# EAGLE design Reserve_nutzen_noholes (EAGLE 6.5.0)

## Sheet 1 of 5
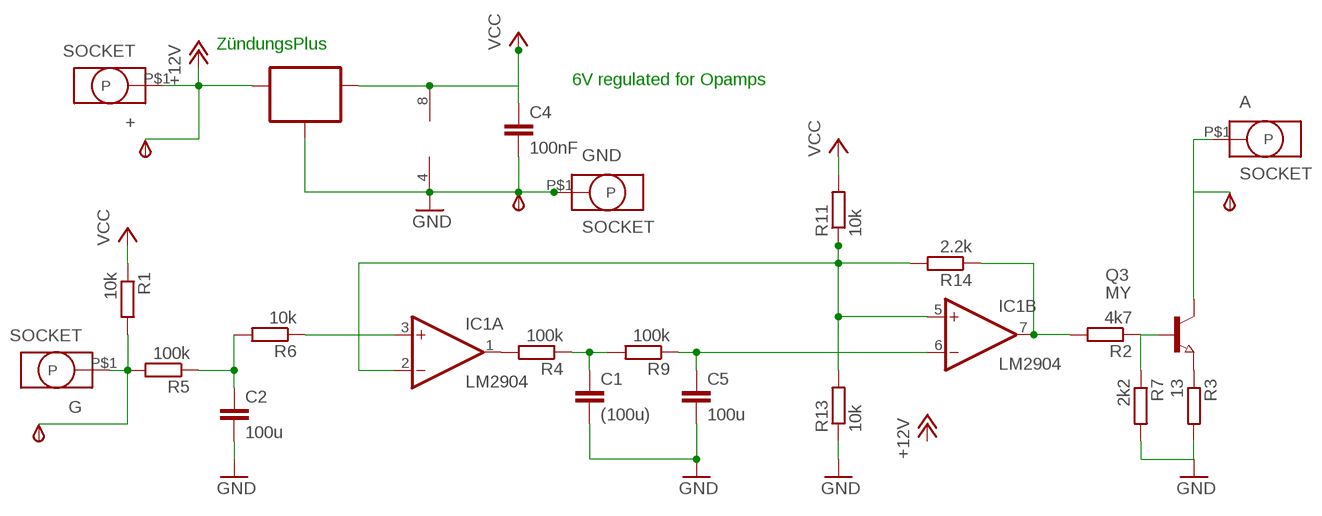
[diagram p0: schematic, sheet 1]

### Parts
+  SOCKET  [ID2.5MM]
A  SOCKET  [ID2.5MM]
C1  (100u)  C-EUC1206K  [C1206K]
C2  100u  C-EUC1206K  [C1206K]
C4  100nF  C-EUC0805  [C0805]
C5  100u  C-EUC1206K  [C1206K]
G  SOCKET  [ID2.5MM]
GND  SOCKET  [ID2.5MM]
GND_  TPSB2.0  [B2.0]
IC1  LM2904  LM358D  [SO08]
IC2  70L06  78LXXSOT89_ROUND  [SOT89_ROUND]
IN  TPSB2.0  [B2.0]
OUT  TPSB2.0  [B2.0]
Q3  MY  NPN-TRANSISTOR_SOT89  [SOT89]
R1  10k  R-EU_R0805  [R0805]
R2  4k7  R-EU_R0805  [R0805]
R3  13  R-EU_R1206  [R1206]
R4  100k  R-EU_R0805  [R0805]
R5  100k  R-EU_R0805  [R0805]
R6  10k  R-EU_R0805  [R0805]
R7  2k2  R-EU_R0805  [R0805]
R9  100k  R-EU_R0805  [R0805]
R11  10k  R-EU_R0805  [R0805]
R13  10k  R-EU_R0805  [R0805]
R14  2.2k  R-EU_R0805  [R0805]
V+  TPSB2.0  [B2.0]

### Nets
+12V: +.P$1(P) IC2.3(IN) V+.TP(PP)
GND: C1.2 C2.2 C4.2 C5.2 GND.P$1(P) GND_.TP(PP) IC1.4(P:V-) IC2.2(GND) IC2.2@1(GND) R3.2 R7.2 R13.1
N$1: C2.1 R5.1 R6.2
N$2: Q3.1(B) R2.1 R7.1
N$3: C1.1 R4.1 R9.2
N$4: C5.1 IC1.6(B:-IN) R9.1
N$5: IC1.2(A:-IN) IC1.5(B:+IN) R11.1 R13.2 R14.2
N$6: G.P$1(P) IN.TP(PP) R1.2 R5.2
N$7: Q3.3(E) R3.1
N$9: IC1.3(A:+IN) R6.1
N$10: IC1.7(B:OUT) R2.2 R14.1
N$11: A.P$1(P) OUT.TP(PP) Q3.2(C)
N$580: IC1.1(A:OUT) R4.2
VCC: C4.1 IC1.8(P:V+) IC2.1(OUT) R1.1 R11.2

### Notes on the sheet
- ZündungsPlus
- 6V regulated for Opamps

## Sheet 2 of 5
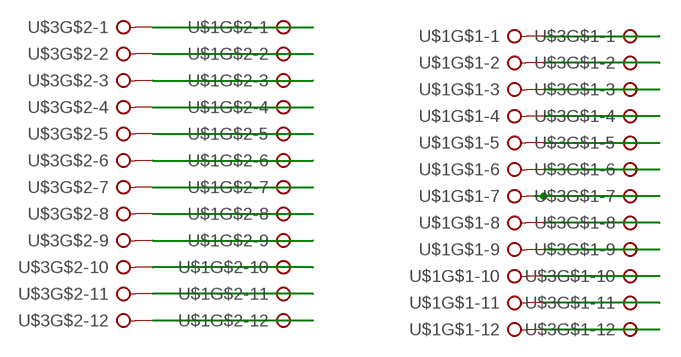
[diagram p1: schematic, sheet 2]

### Parts
U$1  TESTADAPTER-24P  [24-PIN-TESTADAPTER]
U$3  TESTADAPTER-24P24-PIN-ANSCHLUSS  [24-PIN-ANSCHLUSS]

### Nets
N$20: U$1.P$2-1 U$3.P$2-1
N$21: U$1.P$2-2 U$3.P$2-2
N$22: U$1.P$2-3 U$3.P$2-3
N$23: U$1.P$2-4 U$3.P$2-4
N$24: U$1.P$2-5 U$3.P$2-5
N$25: U$1.P$2-6 U$3.P$2-6
N$26: U$1.P$2-7 U$3.P$2-7
N$27: U$1.P$2-8 U$3.P$2-8
N$28: U$1.P$2-9 U$3.P$2-9
N$29: U$1.P$2-10 U$3.P$2-10
N$30: U$1.P$2-11 U$3.P$2-11
N$31: U$1.P$2-12 U$3.P$2-12
N$32: U$1.P$1-2 U$3.P$1-2
N$33: U$1.P$1-3 U$3.P$1-3
N$34: U$1.P$1-4 U$3.P$1-4
N$35: U$1.P$1-6 U$3.P$1-6
N$36: U$1.P$1-7 U$3.P$1-7
N$37: U$1.P$1-8 U$3.P$1-8
N$38: U$1.P$1-9 U$3.P$1-9
N$39: U$1.P$1-10 U$3.P$1-10
N$40: U$1.P$1-11 U$3.P$1-11
N$41: U$1.P$1-12 U$3.P$1-12
N$42: U$1.P$1-5 U$3.P$1-5
N$43: U$1.P$1-1 U$3.P$1-1

## Sheet 3 of 5
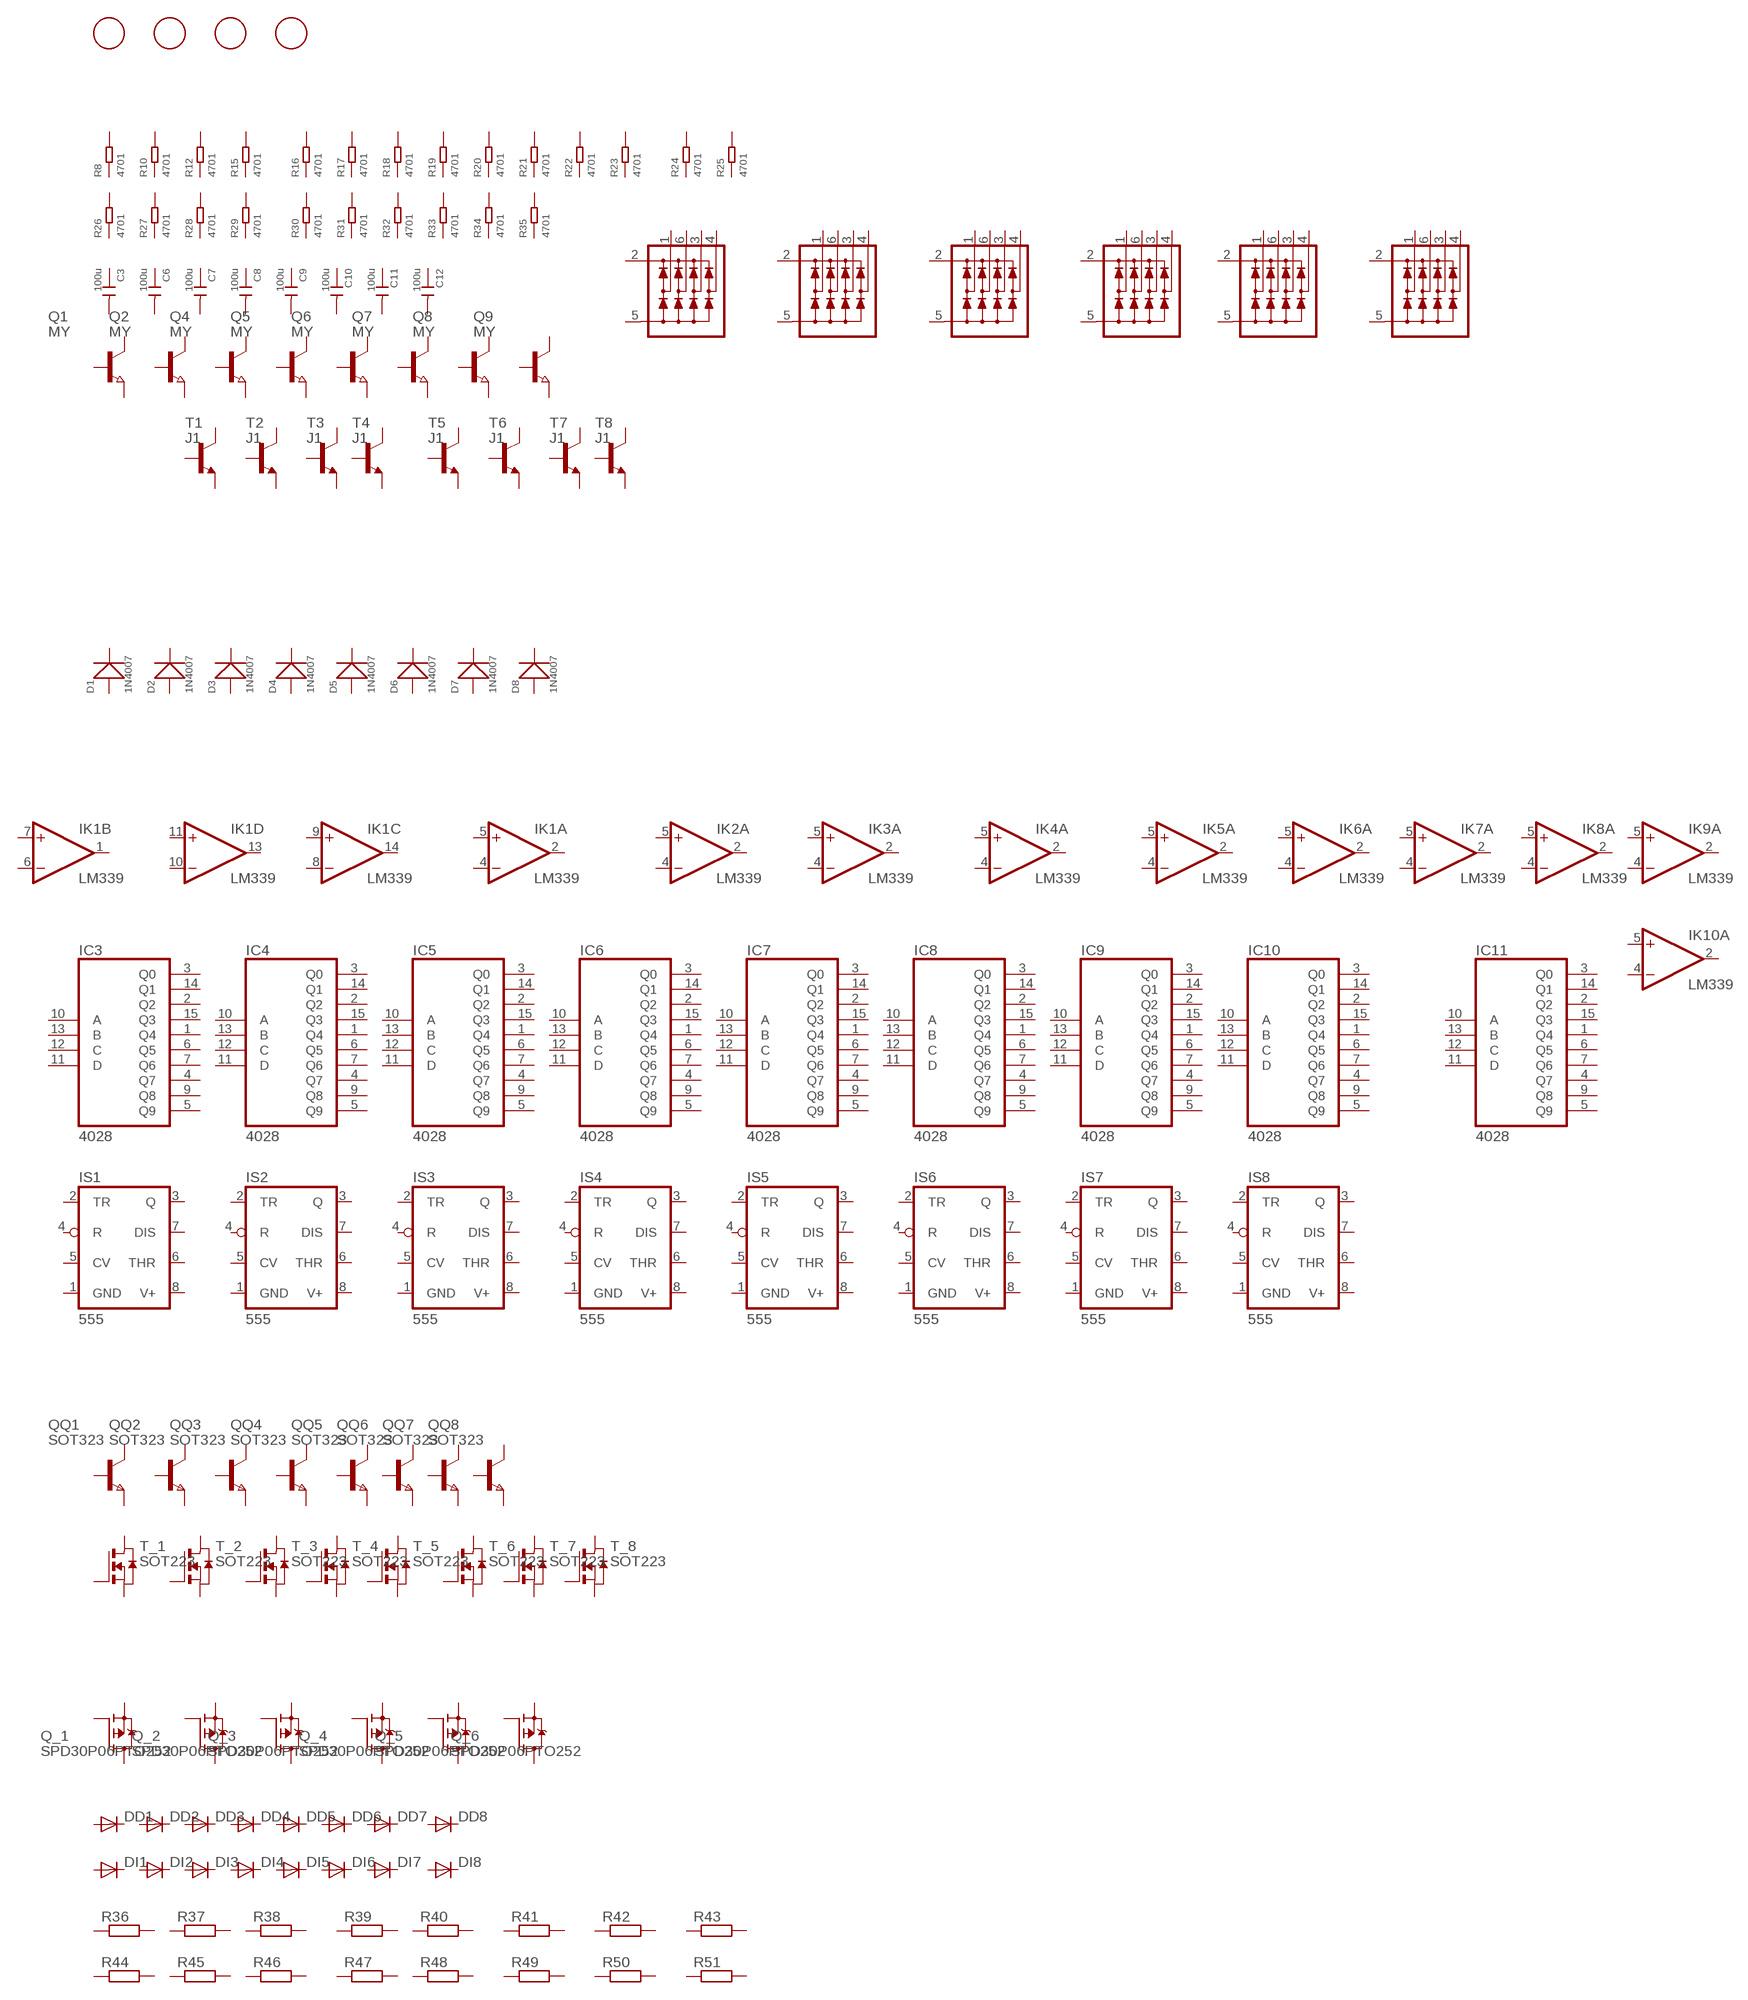
[diagram p2: schematic, sheet 3]

### Parts
C3  100u  CERAMIC-100UF-6.3V-20%-X5R(1206)  [C1206]
C6  100u  CERAMIC-100UF-6.3V-20%-X5R(1206)  [C1206]
C7  100u  CERAMIC-100UF-6.3V-20%-X5R(1206)  [C1206]
C8  100u  CERAMIC-100UF-6.3V-20%-X5R(1206)  [C1206]
C9  100u  CERAMIC-100UF-6.3V-20%-X5R(1206)  [C1206]
C10  100u  CERAMIC-100UF-6.3V-20%-X5R(1206)  [C1206]
C11  100u  CERAMIC-100UF-6.3V-20%-X5R(1206)  [C1206]
C12  100u  CERAMIC-100UF-6.3V-20%-X5R(1206)  [C1206]
D1  1N4007  DIODE-GEN-PURPOSE-1KV-1A(DO-214AC)  [DO-214AC]
D2  1N4007  DIODE-GEN-PURPOSE-1KV-1A(DO-214AC)  [DO-214AC]
D3  1N4007  DIODE-GEN-PURPOSE-1KV-1A(DO-214AC)  [DO-214AC]
D4  1N4007  DIODE-GEN-PURPOSE-1KV-1A(DO-214AC)  [DO-214AC]
D5  1N4007  DIODE-GEN-PURPOSE-1KV-1A(DO-214AC)  [DO-214AC]
D6  1N4007  DIODE-GEN-PURPOSE-1KV-1A(DO-214AC)  [DO-214AC]
D7  1N4007  DIODE-GEN-PURPOSE-1KV-1A(DO-214AC)  [DO-214AC]
D8  1N4007  DIODE-GEN-PURPOSE-1KV-1A(DO-214AC)  [DO-214AC]
DD1  DIODE-SOD123  [SOD123]
DD2  DIODE-SOD123  [SOD123]
DD3  DIODE-SOD123  [SOD123]
DD4  DIODE-SOD123  [SOD123]
DD5  DIODE-SOD123  [SOD123]
DD6  DIODE-SOD123  [SOD123]
DD7  DIODE-SOD123  [SOD123]
DD8  DIODE-SOD123  [SOD123]
DI1  DIODE-SOD323-R  [SOD323-R]
DI2  DIODE-SOD323-R  [SOD323-R]
DI3  DIODE-SOD323-R  [SOD323-R]
DI4  DIODE-SOD323-R  [SOD323-R]
DI5  DIODE-SOD323-R  [SOD323-R]
DI6  DIODE-SOD323-R  [SOD323-R]
DI7  DIODE-SOD323-R  [SOD323-R]
DI8  DIODE-SOD323-R  [SOD323-R]
FID1_  FID2  FIDUCIAL  [FIDUCIAL_1MM]
FID2  FID1  FIDUCIAL  [FIDUCIAL_1MM]
FID3_  FIDUCIAL  [FIDUCIAL_1MM]
FID4  FIDUCIAL  [FIDUCIAL_1MM]
IC3  4028  4028D  [SO16]
IC4  4028  4028D  [SO16]
IC5  4028  4028D  [SO16]
IC6  4028  4028D  [SO16]
IC7  4028  4028D  [SO16]
IC8  4028  4028D  [SO16]
IC9  4028  4028D  [SO16]
IC10  4028  4028D  [SO16]
IC11  4028  4028D  [SO16]
IK1  LM339  LM339D  [SO14]
IK2  LM339  LM339D  [SO14]
IK3  LM339  LM339D  [SO14]
IK4  LM339  LM339D  [SO14]
IK5  LM339  LM339D  [SO14]
IK6  LM339  LM339D  [SO14]
IK7  LM339  LM339D  [SO14]
IK8  LM339  LM339D  [SO14]
IK9  LM339  LM339D  [SO14]
IK10  LM339  LM339D  [SO14]
IS1  555  NE555D  [SO08]
IS2  555  NE555D  [SO08]
IS3  555  NE555D  [SO08]
IS4  555  NE555D  [SO08]
IS5  555  NE555D  [SO08]
IS6  555  NE555D  [SO08]
IS7  555  NE555D  [SO08]
IS8  555  NE555D  [SO08]
Q1  MY  NPN-TRANSISTOR_SOT89  [SOT89]
Q2  MY  NPN-TRANSISTOR_SOT89  [SOT89]
Q4  MY  NPN-TRANSISTOR_SOT89  [SOT89]
Q5  MY  NPN-TRANSISTOR_SOT89  [SOT89]
Q6  MY  NPN-TRANSISTOR_SOT89  [SOT89]
Q7  MY  NPN-TRANSISTOR_SOT89  [SOT89]
Q8  MY  NPN-TRANSISTOR_SOT89  [SOT89]
Q9  MY  NPN-TRANSISTOR_SOT89  [SOT89]
Q_1  SPD30P06PTO252  [TO252]
Q_2  SPD30P06PTO252  [TO252]
Q_3  SPD30P06PTO252  [TO252]
Q_4  SPD30P06PTO252  [TO252]
Q_5  SPD30P06PTO252  [TO252]
Q_6  SPD30P06PTO252  [TO252]
QQ1  SOT323  NPNSOT323  [SOT323]
QQ2  SOT323  NPNSOT323  [SOT323]
QQ3  SOT323  NPNSOT323  [SOT323]
QQ4  SOT323  NPNSOT323  [SOT323]
QQ5  SOT323  NPNSOT323  [SOT323]
QQ6  SOT323  NPNSOT323  [SOT323]
QQ7  SOT323  NPNSOT323  [SOT323]
QQ8  SOT323  NPNSOT323  [SOT323]
R8  4701  SMD-RES-4.7K-5%-1/8W(0805)  [R0805]
R10  4701  SMD-RES-4.7K-5%-1/8W(0805)  [R0805]
R12  4701  SMD-RES-4.7K-5%-1/8W(0805)  [R0805]
R15  4701  SMD-RES-4.7K-5%-1/8W(0805)  [R0805]
R16  4701  SMD-RES-4.7K-5%-1/8W(0805)  [R0805]
R17  4701  SMD-RES-4.7K-5%-1/8W(0805)  [R0805]
R18  4701  SMD-RES-4.7K-5%-1/8W(0805)  [R0805]
R19  4701  SMD-RES-4.7K-5%-1/8W(0805)  [R0805]
R20  4701  SMD-RES-4.7K-5%-1/8W(0805)  [R0805]
R21  4701  SMD-RES-4.7K-5%-1/8W(0805)  [R0805]
R22  4701  SMD-RES-4.7K-5%-1/8W(0805)  [R0805]
R23  4701  SMD-RES-4.7K-5%-1/8W(0805)  [R0805]
R24  4701  SMD-RES-4.7K-5%-1/8W(0805)  [R0805]
R25  4701  SMD-RES-4.7K-5%-1/8W(0805)  [R0805]
R26  4701  SMD-RES-4.7K-5%-1/8W(0805)  [R0805]
R27  4701  SMD-RES-4.7K-5%-1/8W(0805)  [R0805]
R28  4701  SMD-RES-4.7K-5%-1/8W(0805)  [R0805]
R29  4701  SMD-RES-4.7K-5%-1/8W(0805)  [R0805]
R30  4701  SMD-RES-4.7K-5%-1/8W(0805)  [R0805]
R31  4701  SMD-RES-4.7K-5%-1/8W(0805)  [R0805]
R32  4701  SMD-RES-4.7K-5%-1/8W(0805)  [R0805]
R33  4701  SMD-RES-4.7K-5%-1/8W(0805)  [R0805]
R34  4701  SMD-RES-4.7K-5%-1/8W(0805)  [R0805]
R35  4701  SMD-RES-4.7K-5%-1/8W(0805)  [R0805]
R36  R-EU_R0603  [R0603]
R37  R-EU_R0603  [R0603]
R38  R-EU_R0603  [R0603]
R39  R-EU_R0603  [R0603]
R40  R-EU_R0603  [R0603]
R41  R-EU_R0603  [R0603]
R42  R-EU_R0603  [R0603]
R43  R-EU_R0603  [R0603]
R44  R-EU_R0402  [R0402]
R45  R-EU_R0402  [R0402]
R46  R-EU_R0402  [R0402]
R47  R-EU_R0402  [R0402]
R48  R-EU_R0402  [R0402]
R49  R-EU_R0402  [R0402]
R50  R-EU_R0402  [R0402]
R51  R-EU_R0402  [R0402]
T1  J1  MMBTA42LT1-NPN-SOT23-BEC  [SOT23-BEC]
T2  J1  MMBTA42LT1-NPN-SOT23-BEC  [SOT23-BEC]
T3  J1  MMBTA42LT1-NPN-SOT23-BEC  [SOT23-BEC]
T4  J1  MMBTA42LT1-NPN-SOT23-BEC  [SOT23-BEC]
T5  J1  MMBTA42LT1-NPN-SOT23-BEC  [SOT23-BEC]
T6  J1  MMBTA42LT1-NPN-SOT23-BEC  [SOT23-BEC]
T7  J1  MMBTA42LT1-NPN-SOT23-BEC  [SOT23-BEC]
T8  J1  MMBTA42LT1-NPN-SOT23-BEC  [SOT23-BEC]
T_1  SOT223  NMOSSOT223  [SOT223]
T_2  SOT223  NMOSSOT223  [SOT223]
T_3  SOT223  NMOSSOT223  [SOT223]
T_4  SOT223  NMOSSOT223  [SOT223]
T_5  SOT223  NMOSSOT223  [SOT223]
T_6  SOT223  NMOSSOT223  [SOT223]
T_7  SOT223  NMOSSOT223  [SOT223]
T_8  SOT223  NMOSSOT223  [SOT223]
U1  NUP4304SOT457_R  [SOT457R_PHILIPS]
U2  NUP4304SOT457_R  [SOT457R_PHILIPS]
U3  NUP4304SOT457_R  [SOT457R_PHILIPS]
U4  NUP4304SOT457_R  [SOT457R_PHILIPS]
U5  NUP4304SOT457_R  [SOT457R_PHILIPS]
U6  NUP4304SOT457_R  [SOT457R_PHILIPS]
Unconnected: C3.1 C3.2 C6.1 C6.2 C7.1 C7.2 C8.1 C8.2 C9.1 C9.2 C10.1 C10.2 C11.1 C11.2 C12.1 C12.2 D1.1(+) D1.2(-) D2.1(+) D2.2(-) D3.1(+) D3.2(-) D4.1(+) D4.2(-) D5.1(+) D5.2(-) D6.1(+) D6.2(-) D7.1(+) D7.2(-) D8.1(+) D8.2(-) DD1.A DD1.C DD2.A DD2.C DD3.A DD3.C DD4.A DD4.C DD5.A DD5.C DD6.A DD6.C DD7.A DD7.C DD8.A DD8.C DI1.A DI1.C DI2.A DI2.C DI3.A DI3.C DI4.A DI4.C DI5.A DI5.C DI6.A DI6.C DI7.A DI7.C DI8.A DI8.C IC3.1(Q4) IC3.2(Q2) IC3.3(Q0) IC3.4(Q7) IC3.5(Q9) IC3.6(Q5) IC3.7(Q6) IC3.9(Q8) IC3.10(A) IC3.11(D) IC3.12(C) IC3.13(B) IC3.14(Q1) IC3.15(Q3) IC4.1(Q4) IC4.2(Q2) IC4.3(Q0) IC4.4(Q7) IC4.5(Q9) IC4.6(Q5) IC4.7(Q6) IC4.9(Q8) IC4.10(A) IC4.11(D) IC4.12(C) IC4.13(B) IC4.14(Q1) IC4.15(Q3) IC5.1(Q4) IC5.2(Q2) IC5.3(Q0) IC5.4(Q7) IC5.5(Q9) IC5.6(Q5) IC5.7(Q6) IC5.9(Q8) IC5.10(A) IC5.11(D) IC5.12(C) IC5.13(B) IC5.14(Q1) IC5.15(Q3) IC6.1(Q4) IC6.2(Q2) IC6.3(Q0) IC6.4(Q7) IC6.5(Q9) IC6.6(Q5) IC6.7(Q6) IC6.9(Q8) IC6.10(A) IC6.11(D) IC6.12(C) IC6.13(B) IC6.14(Q1) IC6.15(Q3) IC7.1(Q4) IC7.2(Q2) IC7.3(Q0) IC7.4(Q7) IC7.5(Q9) IC7.6(Q5) IC7.7(Q6) IC7.9(Q8) IC7.10(A) IC7.11(D) IC7.12(C) IC7.13(B) IC7.14(Q1) IC7.15(Q3) IC8.1(Q4) IC8.2(Q2) IC8.3(Q0) IC8.4(Q7) IC8.5(Q9) IC8.6(Q5) IC8.7(Q6) IC8.9(Q8) IC8.10(A) IC8.11(D) IC8.12(C) IC8.13(B) IC8.14(Q1) IC8.15(Q3) IC9.1(Q4) IC9.2(Q2) IC9.3(Q0) IC9.4(Q7) IC9.5(Q9) IC9.6(Q5) IC9.7(Q6) IC9.9(Q8) IC9.10(A) IC9.11(D) IC9.12(C) IC9.13(B) IC9.14(Q1) IC9.15(Q3) IC10.1(Q4) IC10.2(Q2) IC10.3(Q0) IC10.4(Q7) IC10.5(Q9) IC10.6(Q5) IC10.7(Q6) IC10.9(Q8) IC10.10(A) IC10.11(D) IC10.12(C) IC10.13(B) IC10.14(Q1) IC10.15(Q3) IC11.1(Q4) IC11.2(Q2) IC11.3(Q0) IC11.4(Q7) IC11.5(Q9) IC11.6(Q5) IC11.7(Q6) IC11.9(Q8) IC11.10(A) IC11.11(D) IC11.12(C) IC11.13(B) IC11.14(Q1) IC11.15(Q3) IK1.1(B:OUT) IK1.2(A:OUT) IK1.4(A:-IN) IK1.5(A:+IN) IK1.6(B:-IN) IK1.7(B:+IN) IK1.8(C:-IN) IK1.9(C:+IN) IK1.10(D:-IN) IK1.11(D:+IN) IK1.13(D:OUT) IK1.14(C:OUT) IK2.1(B:OUT) IK2.2(A:OUT) IK2.4(A:-IN) IK2.5(A:+IN) IK2.6(B:-IN) IK2.7(B:+IN) IK2.8(C:-IN) IK2.9(C:+IN) IK2.10(D:-IN) IK2.11(D:+IN) IK2.13(D:OUT) IK2.14(C:OUT) IK3.1(B:OUT) IK3.2(A:OUT) IK3.4(A:-IN) IK3.5(A:+IN) IK3.6(B:-IN) IK3.7(B:+IN) IK3.8(C:-IN) IK3.9(C:+IN) IK3.10(D:-IN) IK3.11(D:+IN) IK3.13(D:OUT) IK3.14(C:OUT) IK4.1(B:OUT) IK4.2(A:OUT) IK4.4(A:-IN) IK4.5(A:+IN) IK4.6(B:-IN) IK4.7(B:+IN) IK4.8(C:-IN) IK4.9(C:+IN) IK4.10(D:-IN) IK4.11(D:+IN) IK4.13(D:OUT) IK4.14(C:OUT) IK5.1(B:OUT) IK5.2(A:OUT) IK5.4(A:-IN) IK5.5(A:+IN) IK5.6(B:-IN) IK5.7(B:+IN) IK5.8(C:-IN) IK5.9(C:+IN) IK5.10(D:-IN) IK5.11(D:+IN) IK5.13(D:OUT) IK5.14(C:OUT) IK6.1(B:OUT) IK6.2(A:OUT) IK6.4(A:-IN) IK6.5(A:+IN) IK6.6(B:-IN) IK6.7(B:+IN) IK6.8(C:-IN) IK6.9(C:+IN) IK6.10(D:-IN) IK6.11(D:+IN) IK6.13(D:OUT) IK6.14(C:OUT) IK7.1(B:OUT) IK7.2(A:OUT) IK7.4(A:-IN) IK7.5(A:+IN) IK7.6(B:-IN) IK7.7(B:+IN) IK7.8(C:-IN) IK7.9(C:+IN) IK7.10(D:-IN) IK7.11(D:+IN) IK7.13(D:OUT) IK7.14(C:OUT) IK8.1(B:OUT) IK8.2(A:OUT) IK8.4(A:-IN) IK8.5(A:+IN) IK8.6(B:-IN) IK8.7(B:+IN) IK8.8(C:-IN) IK8.9(C:+IN) IK8.10(D:-IN) IK8.11(D:+IN) IK8.13(D:OUT) IK8.14(C:OUT) IK9.1(B:OUT) IK9.2(A:OUT) IK9.4(A:-IN) IK9.5(A:+IN) IK9.6(B:-IN) IK9.7(B:+IN) IK9.8(C:-IN) IK9.9(C:+IN) IK9.10(D:-IN) IK9.11(D:+IN) IK9.13(D:OUT) IK9.14(C:OUT) IK10.1(B:OUT) IK10.2(A:OUT) IK10.4(A:-IN) IK10.5(A:+IN) IK10.6(B:-IN) IK10.7(B:+IN) IK10.8(C:-IN) IK10.9(C:+IN) IK10.10(D:-IN) IK10.11(D:+IN) IK10.13(D:OUT) IK10.14(C:OUT) IS1.2(TR) IS1.3(Q) IS1.4(R) IS1.5(CV) IS1.6(THR) IS1.7(DIS) IS2.2(TR) IS2.3(Q) IS2.4(R) IS2.5(CV) IS2.6(THR) IS2.7(DIS) IS3.2(TR) IS3.3(Q) IS3.4(R) IS3.5(CV) IS3.6(THR) IS3.7(DIS) IS4.2(TR) IS4.3(Q) IS4.4(R) IS4.5(CV) IS4.6(THR) IS4.7(DIS) IS5.2(TR) IS5.3(Q) IS5.4(R) IS5.5(CV) IS5.6(THR) IS5.7(DIS) IS6.2(TR) IS6.3(Q) IS6.4(R) IS6.5(CV) IS6.6(THR) IS6.7(DIS) IS7.2(TR) IS7.3(Q) IS7.4(R) IS7.5(CV) IS7.6(THR) IS7.7(DIS) IS8.2(TR) IS8.3(Q) IS8.4(R) IS8.5(CV) IS8.6(THR) IS8.7(DIS) Q1.1(B) Q1.2(C) Q1.3(E) Q2.1(B) Q2.2(C) Q2.3(E) Q4.1(B) Q4.2(C) Q4.3(E) Q5.1(B) Q5.2(C) Q5.3(E) Q6.1(B) Q6.2(C) Q6.3(E) Q7.1(B) Q7.2(C) Q7.3(E) Q8.1(B) Q8.2(C) Q8.3(E) Q9.1(B) Q9.2(C) Q9.3(E) Q_1.1(G) Q_1.2(S) Q_1.3(D) Q_2.1(G) Q_2.2(S) Q_2.3(D) Q_3.1(G) Q_3.2(S) Q_3.3(D) Q_4.1(G) Q_4.2(S) Q_4.3(D) Q_5.1(G) Q_5.2(S) Q_5.3(D) Q_6.1(G) Q_6.2(S) Q_6.3(D) QQ1.1(C) QQ1.2(B) QQ1.3(E) QQ2.1(C) QQ2.2(B) QQ2.3(E) QQ3.1(C) QQ3.2(B) QQ3.3(E) QQ4.1(C) QQ4.2(B) QQ4.3(E) QQ5.1(C) QQ5.2(B) QQ5.3(E) QQ6.1(C) QQ6.2(B) QQ6.3(E) QQ7.1(C) QQ7.2(B) QQ7.3(E) QQ8.1(C) QQ8.2(B) QQ8.3(E) R8.1 R8.2 R10.1 R10.2 R12.1 R12.2 R15.1 R15.2 R16.1 R16.2 R17.1 R17.2 R18.1 R18.2 R19.1 R19.2 R20.1 R20.2 R21.1 R21.2 R22.1 R22.2 R23.1 R23.2 R24.1 R24.2 R25.1 R25.2 R26.1 R26.2 R27.1 R27.2 R28.1 R28.2 R29.1 R29.2 R30.1 R30.2 R31.1 R31.2 R32.1 R32.2 R33.1 R33.2 R34.1 R34.2 R35.1 R35.2 R36.1 R36.2 R37.1 R37.2 R38.1 R38.2 R39.1 R39.2 R40.1 R40.2 R41.1 R41.2 R42.1 R42.2 R43.1 R43.2 R44.1 R44.2 R45.1 R45.2 R46.1 R46.2 R47.1 R47.2 R48.1 R48.2 R49.1 R49.2 R50.1 R50.2 R51.1 R51.2 T1.B T1.C T1.E T2.B T2.C T2.E T3.B T3.C T3.E T4.B T4.C T4.E T5.B T5.C T5.E T6.B T6.C T6.E T7.B T7.C T7.E T8.B T8.C T8.E T_1.1(G) T_1.2(D) T_1.3(S) T_1.4(D) T_2.1(G) T_2.2(D) T_2.3(S) T_2.4(D) T_3.1(G) T_3.2(D) T_3.3(S) T_3.4(D) T_4.1(G) T_4.2(D) T_4.3(S) T_4.4(D) T_5.1(G) T_5.2(D) T_5.3(S) T_5.4(D) T_6.1(G) T_6.2(D) T_6.3(S) T_6.4(D) T_7.1(G) T_7.2(D) T_7.3(S) T_7.4(D) T_8.1(G) T_8.2(D) T_8.3(S) T_8.4(D) U1.1(D1) U1.2(V+) U1.3(D3) U1.4(D4) U1.5(V-) U1.6(D2) U2.1(D1) U2.2(V+) U2.3(D3) U2.4(D4) U2.5(V-) U2.6(D2) U3.1(D1) U3.2(V+) U3.3(D3) U3.4(D4) U3.5(V-) U3.6(D2) U4.1(D1) U4.2(V+) U4.3(D3) U4.4(D4) U4.5(V-) U4.6(D2) U5.1(D1) U5.2(V+) U5.3(D3) U5.4(D4) U5.5(V-) U5.6(D2) U6.1(D1) U6.2(V+) U6.3(D3) U6.4(D4) U6.5(V-) U6.6(D2)

## Sheet 4 of 5
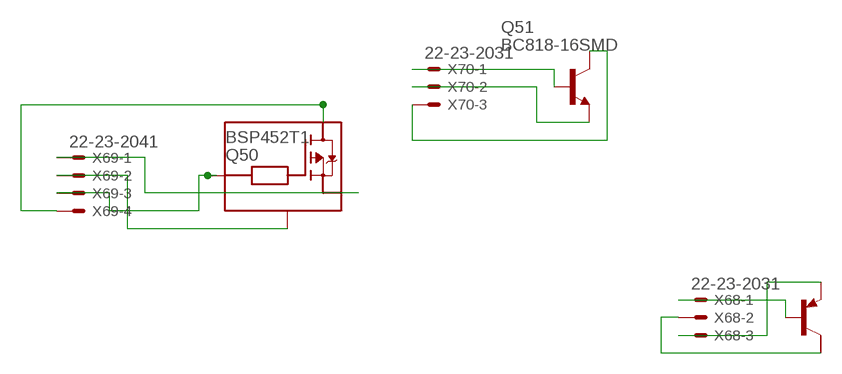
[diagram p3: schematic, sheet 4]

### Parts
Q49  BCP53T1  [SOT223]
Q50  BSP452T1  [SOT223]
Q51  BC818-16SMD  [SOT23-BEC]
X68  22-23-2031  [22-23-2031]
X69  22-23-2041  [22-23-2041]
X70  22-23-2031  [22-23-2031]

### Nets
N$450: Q49.1(B) X68.1
N$451: Q49.2(C) X68.2
N$452: Q49.3(E) X68.3
N$453: Q50.1(OUT) X69.1
N$454: Q50.2(GND) X69.2
N$455: Q50.3(IN) X69.3
N$456: Q50.4(V+) X69.4
N$457: Q51.B X70.1
N$458: Q51.E X70.2
N$459: Q51.C X70.3
Unconnected: Q49.4(C/)

## Sheet 5 of 5
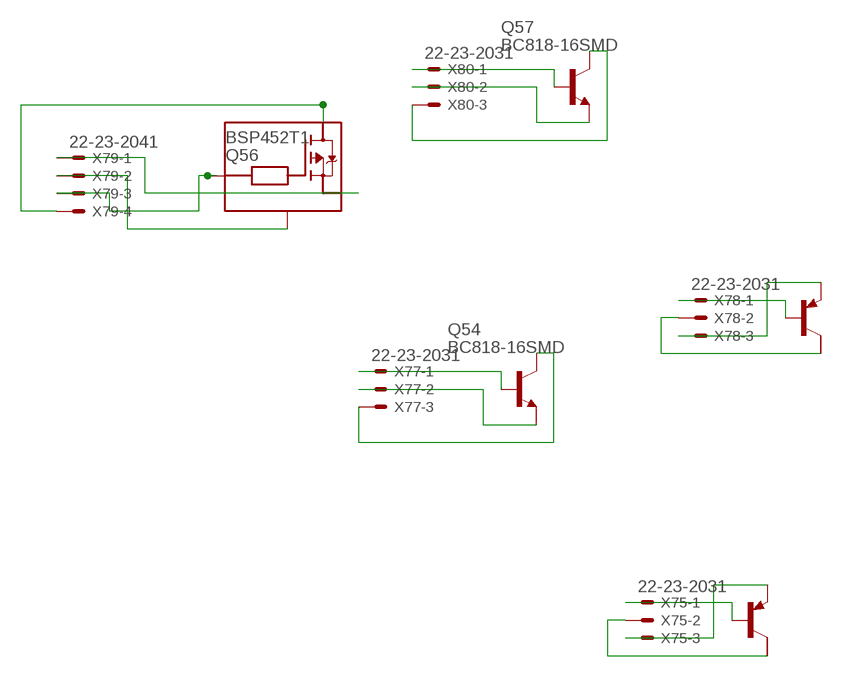
[diagram p4: schematic, sheet 5]

### Parts
Q52  BCP53T1  [SOT223]
Q54  BC818-16SMD  [SOT23-BEC]
Q55  BCP53T1  [SOT223]
Q56  BSP452T1  [SOT223]
Q57  BC818-16SMD  [SOT23-BEC]
X75  22-23-2031  [22-23-2031]
X77  22-23-2031  [22-23-2031]
X78  22-23-2031  [22-23-2031]
X79  22-23-2041  [22-23-2041]
X80  22-23-2031  [22-23-2031]

### Nets
N$500: Q52.1(B) X75.1
N$501: Q52.2(C) X75.2
N$502: Q52.3(E) X75.3
N$507: Q54.B X77.1
N$508: Q54.E X77.2
N$509: Q54.C X77.3
N$510: Q55.1(B) X78.1
N$511: Q55.2(C) X78.2
N$512: Q55.3(E) X78.3
N$513: Q56.1(OUT) X79.1
N$514: Q56.2(GND) X79.2
N$515: Q56.3(IN) X79.3
N$516: Q56.4(V+) X79.4
N$517: Q57.B X80.1
N$518: Q57.E X80.2
N$519: Q57.C X80.3
Unconnected: Q52.4(C/) Q55.4(C/)

## Power pins joined to a net without a drawn wire
GND1: IK1.12(P:GND) IK2.12(P:GND) IK3.12(P:GND) IK4.12(P:GND) IK5.12(P:GND) IK6.12(P:GND) IK7.12(P:GND) IK8.12(P:GND) IK9.12(P:GND) IK10.12(P:GND) IS1.1(GND) IS2.1(GND) IS3.1(GND) IS4.1(GND) IS5.1(GND) IS6.1(GND) IS7.1(GND) IS8.1(GND)
V+: IK1.3(P:V+) IK2.3(P:V+) IK3.3(P:V+) IK4.3(P:V+) IK5.3(P:V+) IK6.3(P:V+) IK7.3(P:V+) IK8.3(P:V+) IK9.3(P:V+) IK10.3(P:V+) IS1.8(V+) IS2.8(V+) IS3.8(V+) IS4.8(V+) IS5.8(V+) IS6.8(V+) IS7.8(V+) IS8.8(V+)
VDD: IC3.16(VDD) IC4.16(VDD) IC5.16(VDD) IC6.16(VDD) IC7.16(VDD) IC8.16(VDD) IC9.16(VDD) IC10.16(VDD) IC11.16(VDD)
VSS: IC3.8(VSS) IC4.8(VSS) IC5.8(VSS) IC6.8(VSS) IC7.8(VSS) IC8.8(VSS) IC9.8(VSS) IC10.8(VSS) IC11.8(VSS)

## Library data of the parts
+ A G GND = Brotbox_Socket_Header:SOCKET
C1 C2 C4 C5 = rcl:C-EU: CAPACITOR, European symbol
C3 C6-C12 = Seeed-Capacitor-2016:CERAMIC-100UF-6.3V-20%-X5R(1206): 302010183; MPN: GRM31CR60J107ME39L; VALUE: 100uf
D1-D8 = Diode-do214ac:DIODE-GEN-PURPOSE-1KV-1A(DO-214AC): 304010013; MPN: 1N4007
DD1-DD8 DI1-DI8 = diode:DIODE-: DIODE
FID1_ FID2 FID3_ FID4 = Fiducial:FIDUCIAL: For use by pick and place machines to calibrate the vision/machine, 1mm By microbuilder.eu
GND_ IN OUT V+ = testpin_BMW:TPS: TEST PIN
IC1 = linear_BMW:LM358: OP AMP also LM158; LM258; LM2904 Source: http://cache.national.com/ds/LM/LM158.pdf
IC2 = 78LXX:78LXX
IC3-IC11 = 4028:4028: BCD to decimal DECODER
IK1-IK10 = LM339:LM339: Low Power Low Offset Voltage Quad Comparators with open collector; LM139/LM239/LM339/LM2901/LM3302
IS1-IS8 = linear:*555: TIMER
Q1-Q9 = Transistor_SOT89:NPN-TRANSISTOR_: NPN TRANSISTOR
Q49 Q52 Q55 = BCP53_:BCP53*
Q50 Q56 = BSP452:BSP452
Q51 Q54 Q57 = transistor-npn:BC818*: NPN Transistor
Q_1-Q_6 = transistor-fet:SPD30P06P: SIPMOS(R) Power-Transistor P-Channel, Enhancement mode Source: http://www.infineon.com/upload/Document/cmc_upload/documents/012/3615/SPD_U30P06P.pdf
QQ1-QQ8 = zetex:NPNSOT323: NPN TRANSISTOR; MPN: DSS4160U-7; OC_FARNELL: 1710696; OC_NEWARK: 25R4558
R1-R7 R9 R11 R13 R14 R36-R51 = rcl:R-EU_: RESISTOR, European symbol
R8 R10 R12 R15-R35 = Seeed-Resistor-2016:SMD-RES-4.7K-5%-1/8W(0805): 301010306; MPN: RC0805JR-074K7L; VALUE: 4.7K
T1-T8 = transistor:*-NPN-: NPN Transistror BF959 corrected 2008.03.06
T_1-T_8 = zetex_nmos_BSP78:NMOSSOT223: MOS FET; OC_FARNELL: unknown; OC_NEWARK: unknown
U1-U6 = NUP4304_ESD_Diode_Array:NUP4304
U$1 U$3 = con WAGO BMW:TESTADAPTER-24P: Testadapter mit Pogo Pins um Kontakt mit Wago Leiste herzustellen
X68 X70 X75 X77 X78 X80 = con-molex:22-23-2031: .100" (2.54mm) Center Header - 3 Pin; MF: MOLEX; MPN: 22-23-2031; OC_FARNELL: 1462950; OC_NEWARK: 30C0862
X69 X79 = con-molex:22-23-2041: .100" (2.54mm) Center Header - 4 Pin; MF: MOLEX; MPN: 22-23-2041; OC_FARNELL: 1462920; OC_NEWARK: 38C0355

## Board
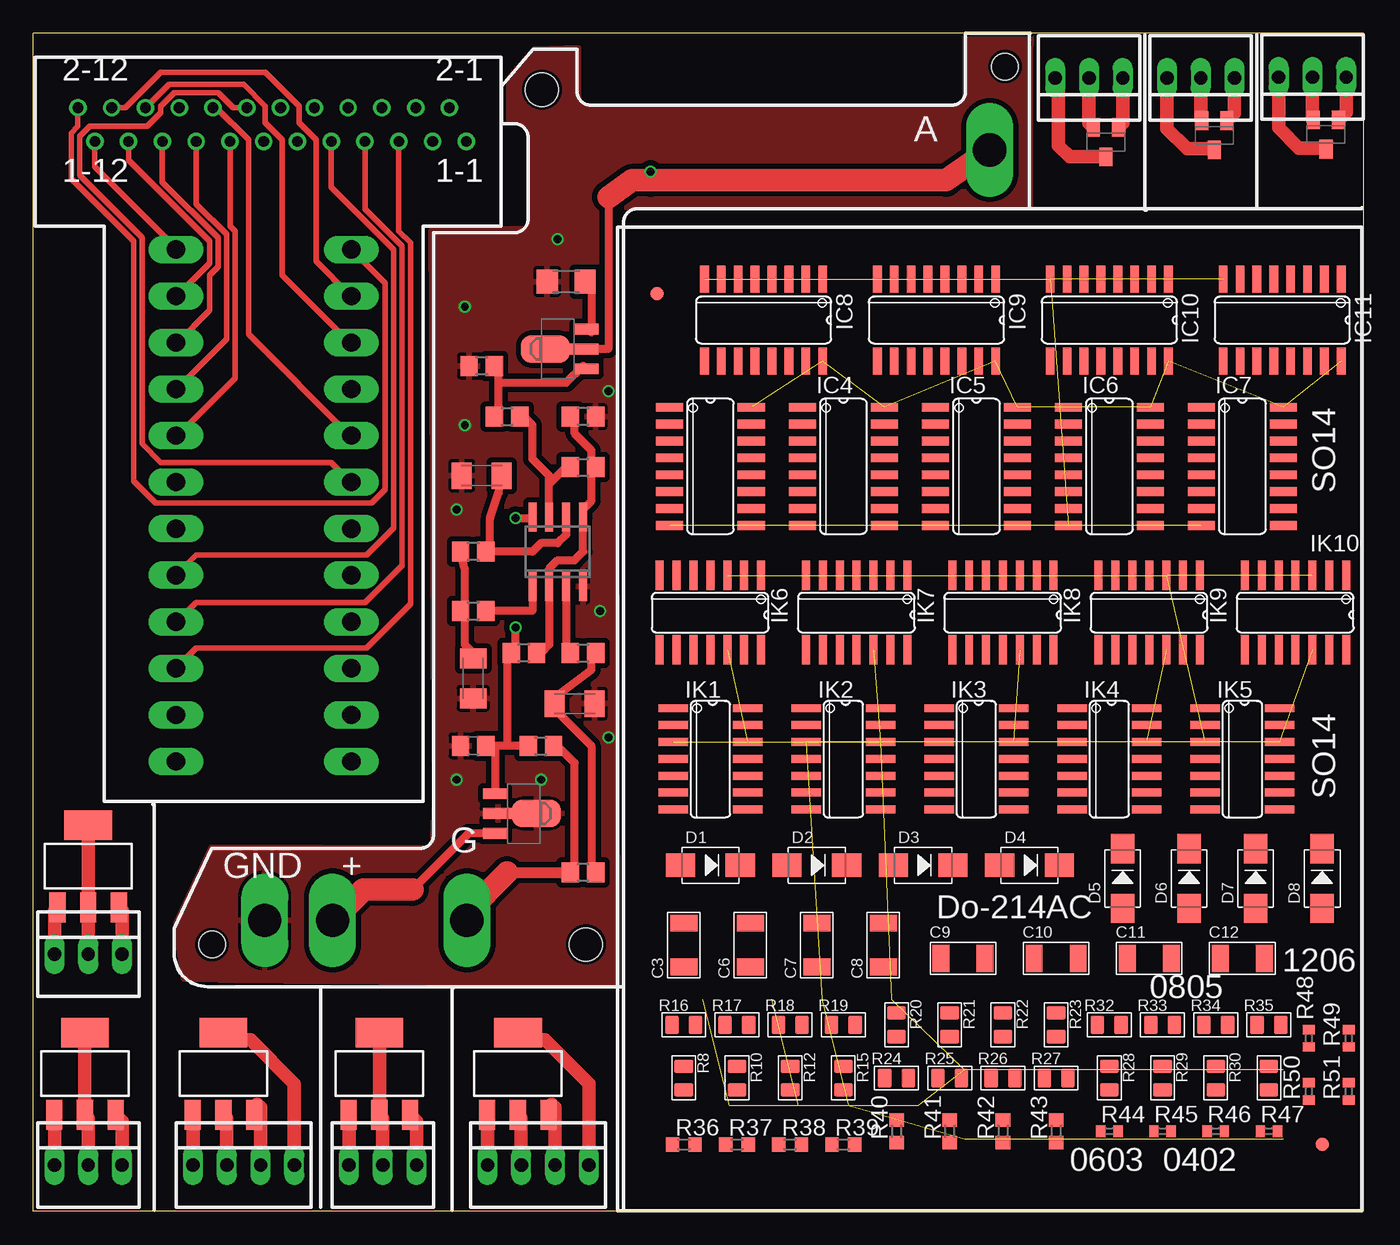
[diagram p5: board, top side]
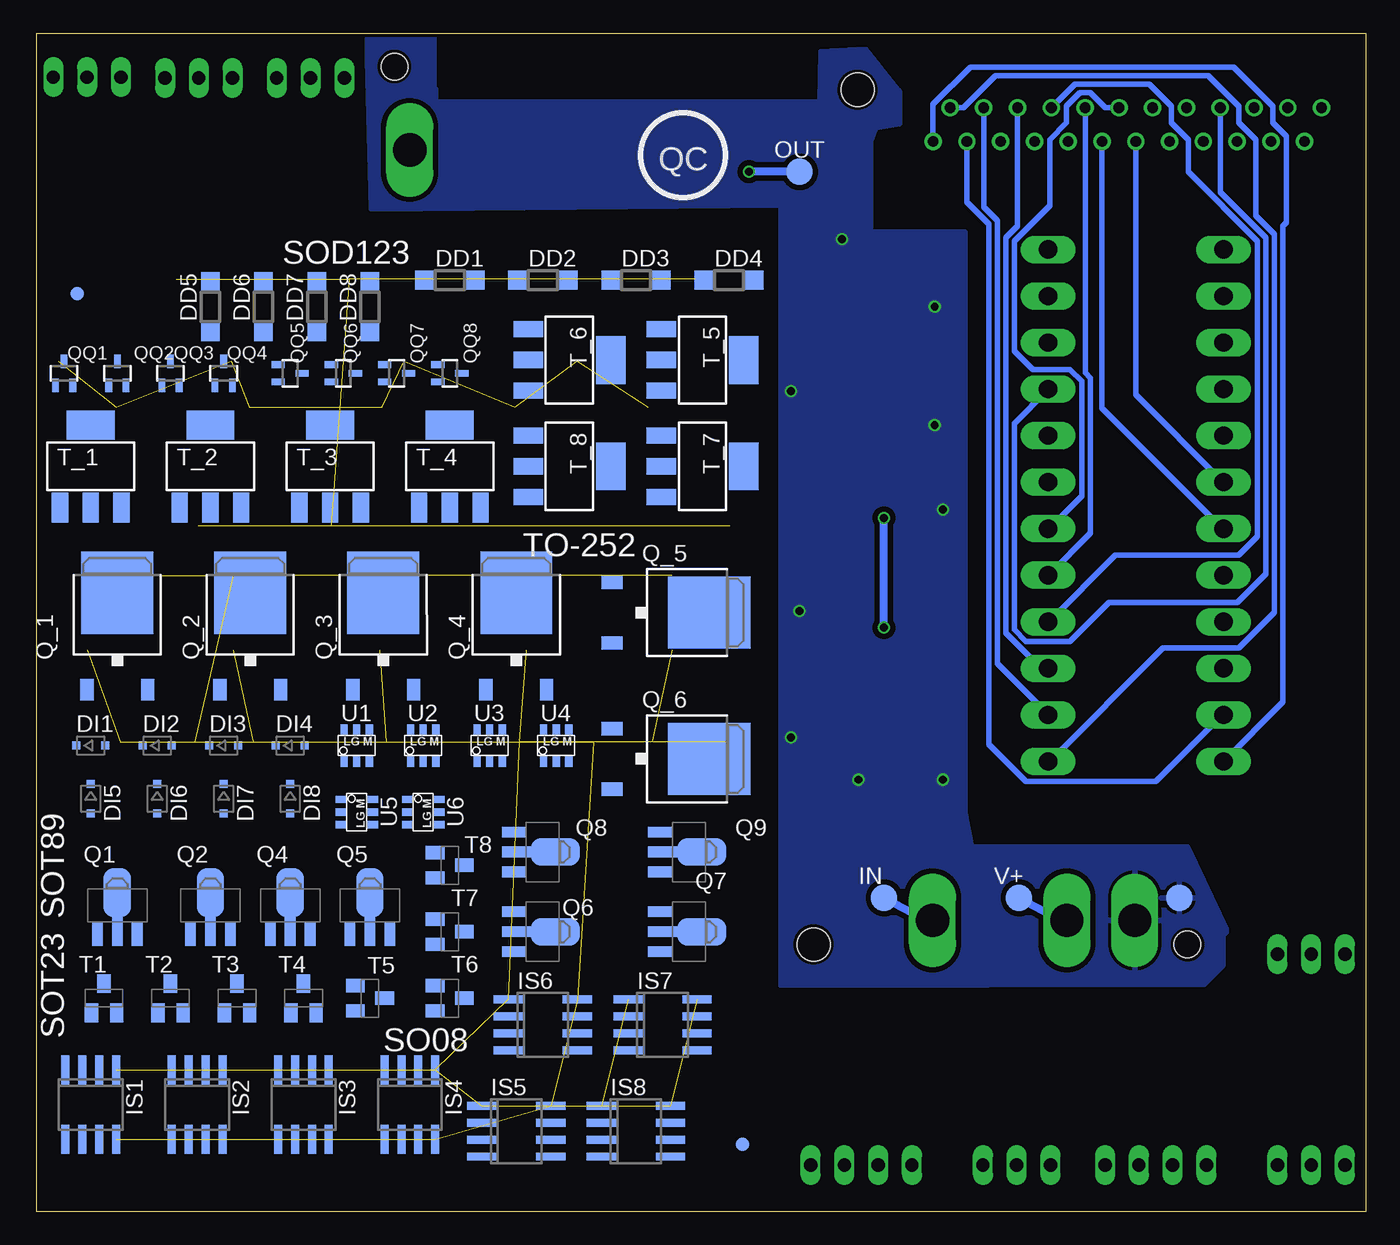
[diagram p6: board, bottom side, seen from below]

Size 100 x 88.6 mm. Coordinates in mm from the lower left corner, seen from the top.
Outline: 100,88.6 100,0 0,0 0,88.6 100,88.6
Copper layers (1*16): Top 0.035mm / dielectric 1.5mm / Bottom 0.035mm
Design rules "SeeedStudio_2layer_DRU_no_angle_20140221 *": minimum track width 24mil, minimum drill 12mil, track to track 0.4mm, track to pad 0.4mm, pad to pad 0.4mm, via to via 0.4mm, smd to smd 0mil, copper to edge 10mil, drill to drill 10mil, minimum pad ring 10mil, minimum via ring 6mil, stop-mask expansion 2mil, vias tented up to drill 100mil, thermal gap 10mil
Holes 2.5 mm at 41.56,20.07 38.25,84.35
Holes 2 mm at 73.08,86.09 13.44,20.07

### Footprints (pad centres in the part's own frame; a part is rotated, then mirrored left to right if it is on the bottom)
ID2.5MM = drill 2.5 long: P$1 0,0
C1206K = smd 1.5 x 2: 1 -1.5,0; 2 1.5,0
C1206 = smd 1.27 x 2.032: 1 -1.651,0; 2 1.651,0
C0805 = smd 1.3 x 1.5: 1 -0.95,0; 2 0.95,0
DO-214AC = smd 2.2 x 1.77: 1 -2.242,0; 2 2.242,0
SOD123 = smd 1.4 x 1.4: A 1.9,0; C -1.9,0
SOD323-R = smd 0.6 x 0.6: A 1.1,0; C -1.1,0
FIDUCIAL_1MM = smd 1 x 1: 1 0,0
B2.0 = smd 2 x 2: TP 0,0
SO08 = smd 0.6 x 2.2: 1 -1.905,-2.6; 2 -0.635,-2.6; 3 0.635,-2.6; 4 1.905,-2.6; 5 1.905,2.6; 6 0.635,2.6; 7 -0.635,2.6; 8 -1.905,2.6
SOT89_ROUND = smd 0.8 x 1.8: 1 -1.499,-2.181; 3 1.499,-2.181 | smd 0.8 x 2.3: 2 0,-1.927 | smd 2.032 x 3.65: 2@1 0,0.94
SO16 = smd 0.66 x 2.032: 1 -4.445,-3.073; 2 -3.175,-3.073; 3 -1.905,-3.073; 4 -0.635,-3.073; 5 0.635,-3.073; 6 1.905,-3.073; 7 3.175,-3.073; 8 4.445,-3.073; 9 4.445,3.073; 10 3.175,3.073; 11 1.905,3.073; 12 0.635,3.073; 13 -0.635,3.073; 14 -1.905,3.073; 15 -3.175,3.073; 16 -4.445,3.073
SO14 = smd 0.6 x 2.2: 1 -3.81,-2.8; 2 -2.54,-2.8; 3 -1.27,-2.8; 4 0,-2.8; 5 1.27,-2.8; 6 2.54,-2.8; 7 3.81,-2.8; 8 3.81,2.8; 9 2.54,2.8; 10 1.27,2.8; 11 0,2.8; 12 -1.27,2.8; 13 -2.54,2.8; 14 -3.81,2.8
SOT89 = smd 0.8 x 1.8: 1 -1.499,-2.181; 3 1.499,-2.181 | smd 0.8 x 2.3: 2 0,-1.927 | smd 2.032 x 3.65: 2@1 0,0.94
SOT223 = smd 1.219 x 2.235: 1 -2.311,-3.099; 2 0,-3.099; 3 2.311,-3.099 | smd 3.6 x 2.2: 4 0,3.099
SOT23-BEC = smd 1 x 1.4: B -0.95,-1.1; C 0,1.1; E 0.95,-1.1
TO252 = smd 1 x 1.6: 1 -2.28,-4.8; 2 2.28,-4.8 | smd 5.4 x 6.2: 3 0,2.5
SOT323 = smd 0.5 x 1: 1 0,0.9; 2 -0.65,-0.9; 3 0.65,-0.9
R0805 = smd 1.3 x 1.5: 1 -0.95,0; 2 0.95,0
R1206 = smd 1.6 x 1.803: 1 -1.422,0; 2 1.422,0
R0805' = smd 1.397 x 1.016: 1 0,0.889; 2 0,-0.889
R0603 = smd 1 x 1.1: 1 -0.85,0; 2 0.85,0
R0402 = smd 0.7 x 0.9: 1 -0.65,0; 2 0.65,0
SOT457R_PHILIPS = smd 0.55 x 0.8: 1 -0.95,-1.2; 2 0,-1.2; 3 0.95,-1.2; 4 0.95,1.2; 5 0,1.2; 6 -0.95,1.2
24-PIN-TESTADAPTER = drill 1.37 long: P$1-1 6.6,19.25; P$1-2 6.6,15.75; P$1-3 6.6,12.25; P$1-4 6.6,8.75; P$1-5 6.6,5.25; P$1-6 6.6,1.75; P$1-7 6.6,-1.75; P$1-8 6.6,-5.25; P$1-9 6.6,-8.75; P$1-10 6.6,-12.25; P$1-11 6.6,-15.75; P$1-12 6.6,-19.25; P$2-1 -6.6,19.25; P$2-2 -6.6,15.75; P$2-3 -6.6,12.25; P$2-4 -6.6,8.75; P$2-5 -6.6,5.25; P$2-6 -6.6,1.75; P$2-7 -6.6,-1.75; P$2-8 -6.6,-5.25; P$2-9 -6.6,-8.75; P$2-10 -6.6,-12.25; P$2-11 -6.6,-15.75; P$2-12 -6.6,-19.25
24-PIN-ANSCHLUSS = drill 0.8: P$1-1 0,0; P$1-2 2.54,0; P$1-3 5.08,0; P$1-4 7.62,0; P$1-5 10.16,0; P$1-6 12.7,0; P$1-7 15.24,0; P$1-8 17.78,0; P$1-9 20.32,0; P$1-10 22.86,0; P$1-11 25.4,0; P$1-12 27.94,0; P$2-1 1.27,-2.54; P$2-2 3.81,-2.54; P$2-3 6.35,-2.54; P$2-4 8.89,-2.54; P$2-5 11.43,-2.54; P$2-6 13.97,-2.54; P$2-7 16.51,-2.54; P$2-8 19.05,-2.54; P$2-9 21.59,-2.54; P$2-10 24.13,-2.54; P$2-11 26.67,-2.54; P$2-12 29.21,-2.54
22-23-2031 = drill 1 long: 1 -2.54,0; 2 0,0; 3 2.54,0
22-23-2041 = drill 1 long: 1 -3.81,0; 2 -1.27,0; 3 1.27,0; 4 3.81,0

### Placement (x,y rotation side)
+  22.51,21.89 90 top
A  71.93,79.82 90 top
C1  33.09,40.08 270 top
C2  40.71,38.18 0 top
C3  48.92,20.03 90 top
C4  33.09,35 180 top
C5  33.73,55.32 180 top
C6  53.92,20.03 90 top
C7  58.92,20.03 90 top
C8  63.92,20.03 90 top
C9  69.92,19.03 0 top
C10  76.92,19.03 0 top
C11  83.92,19.03 0 top
C12  90.92,19.03 0 top
D1  50.92,26.03 0 top
D2  58.92,26.03 0 top
D3  66.92,26.03 0 top
D4  74.92,26.03 0 top
D5  81.92,25.03 90 top
D6  86.92,25.03 90 top
D7  91.92,25.03 90 top
D8  96.92,25.03 90 top
DD1  68.92,70.03 0 bottom
DD2  61.92,70.03 0 bottom
DD3  54.92,70.03 0 bottom
DD4  47.92,70.03 0 bottom
DD5  86.92,68.03 90 bottom
DD6  82.92,68.03 90 bottom
DD7  78.92,68.03 90 bottom
DD8  74.92,68.03 90 bottom
DI1  95.92,35.03 0 bottom
DI2  90.92,35.03 0 bottom
DI3  85.92,35.03 0 bottom
DI4  80.92,35.03 0 bottom
DI5  95.92,31.03 270 bottom
DI6  90.92,31.03 270 bottom
DI7  85.92,31.03 270 bottom
DI8  80.92,31.03 270 bottom
FID1_  46.92,69.03 0 top
FID2  96.92,5.03 0 top
FID3_  96.92,69.03 0 bottom
FID4  46.92,5.03 0 bottom
G  32.61,21.89 90 top
GND  17.41,21.89 90 top
GND_  14.04,23.57 0 bottom
IC1  39.44,49.61 0 top
IC2  36.9,29.92 270 top
IC3  50.92,56.03 270 top
IC4  60.92,56.03 270 top
IC5  70.92,56.03 270 top
IC6  80.92,56.03 270 top
IC7  90.92,56.03 270 top
IC8  54.92,67.03 180 top
IC9  67.92,67.03 180 top
IC10  80.92,67.03 180 top
IC11  93.92,67.03 180 top
IK1  50.92,34.03 270 top
IK2  60.92,34.03 270 top
IK3  70.92,34.03 270 top
IK4  80.92,34.03 270 top
IK5  90.92,34.03 270 top
IK6  50.92,45.03 180 top
IK7  61.92,45.03 180 top
IK8  72.92,45.03 180 top
IK9  83.92,45.03 180 top
IK10  94.92,45.03 180 top
IN  36.27,23.57 0 bottom
IS1  95.92,8.03 180 bottom
IS2  87.92,8.03 180 bottom
IS3  79.92,8.03 180 bottom
IS4  71.92,8.03 180 bottom
IS5  63.92,6.03 270 bottom
IS6  61.92,14.03 270 bottom
IS7  52.92,14.03 270 bottom
IS8  54.92,6.03 270 bottom
OUT  42.62,78.19 0 bottom
Q1  93.92,23.03 0 bottom
Q2  86.92,23.03 0 bottom
Q3  39.44,64.85 90 top
Q4  80.92,23.03 0 bottom
Q5  74.92,23.03 0 bottom
Q6  61.92,21.03 270 bottom
Q7  50.92,21.03 270 bottom
Q8  61.92,27.03 270 bottom
Q9  50.92,27.03 270 bottom
Q49  26.03,10.35 0 top
Q50  36.45,10.35 0 top
Q51  88.81,80.92 180 top
Q52  4.14,25.95 0 top
Q54  80.66,80.41 180 top
Q55  3.89,10.35 0 top
Q56  14.3,10.35 0 top
Q57  97.21,80.98 180 top
Q_1  93.92,44.03 0 bottom
Q_2  83.92,44.03 0 bottom
Q_3  73.92,44.03 0 bottom
Q_4  63.92,44.03 0 bottom
Q_5  51.92,45.03 270 bottom
Q_6  51.92,34.03 270 bottom
QQ1  97.92,63.03 0 bottom
QQ2  93.92,63.03 0 bottom
QQ3  89.92,63.03 0 bottom
QQ4  85.92,63.03 0 bottom
QQ5  80.92,63.03 270 bottom
QQ6  76.92,63.03 270 bottom
QQ7  72.92,63.03 270 bottom
QQ8  68.92,63.03 270 bottom
R1  38.17,35 0 top
R2  35.63,59.77 0 top
R3  40.08,69.93 180 top
R4  33.09,45.16 0 top
R5  41.34,25.48 180 top
R6  41.34,41.99 0 top
R7  33.73,63.58 180 top
R8  4701  [R0805']  48.92,10.03 0 top
R9  33.09,49.61 180 top
R10  4701  [R0805']  52.92,10.03 0 top
R11  36.9,41.99 180 top
R12  4701  [R0805']  56.92,10.03 0 top
R13  41.34,59.77 180 top
R14  41.34,55.96 0 top
R15  4701  [R0805']  60.92,10.03 0 top
R16  4701  [R0805']  48.92,14.03 90 top
R17  4701  [R0805']  52.92,14.03 90 top
R18  4701  [R0805']  56.92,14.03 90 top
R19  4701  [R0805']  60.92,14.03 90 top
R20  4701  [R0805']  64.92,14.03 0 top
R21  4701  [R0805']  68.92,14.03 0 top
R22  4701  [R0805']  72.92,14.03 0 top
R23  4701  [R0805']  76.92,14.03 0 top
R24  4701  [R0805']  64.92,10.03 90 top
R25  4701  [R0805']  68.92,10.03 90 top
R26  4701  [R0805']  72.92,10.03 90 top
R27  4701  [R0805']  76.92,10.03 90 top
R28  4701  [R0805']  80.92,10.03 0 top
R29  4701  [R0805']  84.92,10.03 0 top
R30  4701  [R0805']  88.92,10.03 0 top
R31  4701  [R0805']  92.92,10.03 0 top
R32  4701  [R0805']  80.92,14.03 90 top
R33  4701  [R0805']  84.92,14.03 90 top
R34  4701  [R0805']  88.92,14.03 90 top
R35  4701  [R0805']  92.92,14.03 90 top
R36  48.92,5.03 0 top
R37  52.92,5.03 0 top
R38  56.92,5.03 0 top
R39  60.92,5.03 0 top
R40  64.92,6.03 90 top
R41  68.92,6.03 90 top
R42  72.92,6.03 90 top
R43  76.92,6.03 90 top
R44  80.92,6.03 0 top
R45  84.92,6.03 0 top
R46  88.92,6.03 0 top
R47  92.92,6.03 0 top
R48  95.92,13.03 90 top
R49  98.92,13.03 90 top
R50  95.92,9.03 90 top
R51  98.92,9.03 90 top
T1  94.92,16.03 0 bottom
T2  89.92,16.03 0 bottom
T3  84.92,16.03 0 bottom
T4  79.92,16.03 0 bottom
T5  74.92,16.03 270 bottom
T6  68.92,16.03 270 bottom
T7  68.92,21.03 270 bottom
T8  68.92,26.03 270 bottom
T_1  95.92,56.03 0 bottom
T_2  86.92,56.03 0 bottom
T_3  77.92,56.03 0 bottom
T_4  68.92,56.03 0 bottom
T_5  49.92,64.03 270 bottom
T_6  59.92,64.03 270 bottom
T_7  49.92,56.03 270 bottom
T_8  59.92,56.03 270 bottom
U1  75.92,35.03 0 bottom
U2  70.92,35.03 0 bottom
U3  65.92,35.03 0 bottom
U4  60.92,35.03 0 bottom
U5  75.92,30.03 270 bottom
U6  70.92,30.03 270 bottom
U$1  17.33,53.09 180 top
U$3  32.57,80.46 180 top
V+  26.1,23.57 0 bottom
X68  26.29,3.5 0 top
X69  37.97,3.5 0 top
X70  87.79,85.24 180 top
X75  4.14,19.35 0 top
X77  79.39,85.23 180 top
X78  4.14,3.5 0 top
X79  15.82,3.5 0 top
X80  96.19,85.3 180 top

### Tracks (layer width: path | path; a pad name or v marks a point on that pad's centre or on a via)
+12V
  Top 0.61: IC2.3 32.73,28.43 28.52,24.21
  Top 1.676: 28.52,24.21 24.83,24.21 +.P$1
  Bottom 0.61: V+.TP 22.51,21.67 +.P$1
GND  (via drill 0.6)
  other vias: 39.44,73.1 32.45,68.02 32.45,59.13 31.82,52.78 43.25,61.67 42.62,45.16 43.25,35.64 38.17,32.46 31.82,32.46
  pour Bottom: 12.73,17.09 44.02,16.99 44.02,75.66 74.8,75.36 75.1,86.61 75.1,88.8 70.1,88.8 70.1,84.4 70,84.4 70,83.4 41.1,83.4 41,87.21 37.66,87.41 35.2,84.3 35.1,84.2 35.1,81.8 36.9,81.5 37.3,80.5 37.3,73.64 30.18,73.64 30.18,29.96 29.67,27.42 13.47,27.42 10.5,21.1 10.8,20.8 10.8,18.5 12.21,17.09
  pour Top: 15.23,17.39 43.92,17.09 43.82,75.52 75,75.52 75,87.41 75.1,88.6 75.1,88.7 70.1,88.7 70.1,83.4 69.8,83.4 69.8,83.1 41,83.1 41,87.51 37.66,87.41 35.8,85.2 35.8,82 37.4,81.6 37.4,73.94 29.91,73.74 30.18,30.76 30.04,27.32 13.43,27.42 10.7,21.6 11.3,17.49
GND1  (17 unrouted)
N$1
  Top 0.61: 39.44,38.18 39.44,37.54 41.98,35 41.98,25.48 R5.1 | 39.44,38.18 39.44,38.81 41.98,40.72 41.98,41.99 R6.2 | 39.44,38.18 C2.1
N$2
  Top 0.61: 34.99,62.31 34.99,59.77 R2.1 | 34.99,62.31 34.99,63.58 R7.1 | 34.99,62.31 40.08,62.31 41.34,63.58 Q3.1
N$3
  Top 0.61: 32.45,45.16 32.45,48.34 R9.2 | 32.45,45.16 32.45,42.62 33.09,41.99 C1.1 | 32.45,45.16 R4.1
N$4
  Top 0.61: IC1.6 40.08,50.88 39.44,50.24 38.17,50.24 37.53,49.61 R9.1 34.36,50.24 34.36,52.15 34.99,54.05 C5.1
N$5
  Top 0.61: R11.1 38.17,41.99 38.8,42.62 IC1.2 38.8,48.34 39.44,48.97 40.71,48.97 41.34,49.61 IC1.5 41.34,52.78 41.98,53.42 41.98,55.96 | 41.98,55.96 41.98,57.23 40.71,58.5 40.71,59.77 R13.2 | 41.98,55.96 R14.2
N$6
  Top 0.61: R1.2 39.44,35 40.71,33.73 40.71,25.48 R5.2
  Top 0.813: 35.63,25.48 R5.2
  Top 1.676: G.P$1 32.61,22.46 35.63,25.48
  Bottom 0.61: IN.TP 32.61,21.67 G.P$1
N$7
  Top 0.61: Q3.3 41.98,66.12 41.98,69.93 R3.1
N$9
  Top 0.61: IC1.3 40.08,41.99 R6.1
N$10
  Top 0.61: IC1.7 38.8,54.69 | 38.8,54.69 38.8,55.32 37.53,56.59 37.53,59.13 36.9,59.77 R2.2 | 38.8,54.69 40.08,55.96 R14.1
N$11  (via drill 0.6)
  Top 0.61: Q3.2 43.25,64.85 43.25,76.28 | v46.42,78.19 46.42,77.55
  Top 1.676: A.P$1 68.65,77.55 46.42,77.55 45.03,77.55 43.25,76.28
  Bottom 0.61: OUT.TP v46.42,78.19
N$20
  Bottom 0.406: U$3.P$2-1 30.28,83 27.87,85.41 11.87,85.41 9.58,83.13 9.58,81.86 8.31,80.59 8.31,74.87 6.92,73.47 6.92,45.03 9.58,42.36 15.3,42.36 23.81,33.85 U$1.P$2-1
N$21
  Bottom 0.406: U$3.P$2-2 28.76,75.51 27.74,74.49 27.74,41.22 23.93,37.41 U$1.P$2-2
N$22
  Bottom 0.406: U$3.P$2-3 26.22,74.11 27.11,73.22 27.11,43.5 24.57,40.96 23.93,40.96 U$1.P$2-3
N$23
  Bottom 0.406: U$3.P$2-4 21.9,84.78 16.31,84.78 14.66,83.13 14.66,81.86 13.39,80.59 13.39,78.17 8.19,72.97 8.19,50.74 9.58,49.34 18.85,49.34 23.81,44.39 U$1.P$2-4
N$24
  Bottom 0.406: U$3.P$2-5 21.14,63.06 20.76,62.68 20.76,51 23.81,47.95 U$1.P$2-5
N$25
  Bottom 0.406: U$3.P$2-6 19.62,83 20.76,84.14 21.52,84.14 22.54,83.13 22.54,81.86 23.81,80.59 23.81,75.63 26.47,72.97 26.47,64.71 25.08,63.31 22.28,63.31 21.39,62.43 21.39,53.79 23.81,51.38 U$1.P$2-6
N$26
  Top 0.406: U$3.P$2-7 15.04,83 13.9,84.14 10.6,84.14 9.58,83.13 9.58,82.62 8.57,81.6 4.25,81.6 3.49,80.84 3.49,77.92 8.19,73.22 8.19,57.73 9.58,56.33 22.41,56.33 23.81,54.93 U$1.P$2-7
N$27
  Top 0.406: U$3.P$2-8 13.77,83 16.19,80.59 16.19,65.98 23.81,58.36 U$1.P$2-8
N$28
  Bottom 0.406: U$3.P$2-9 10.98,76.65 7.55,73.22 7.55,47.95 9.71,45.79 19.36,45.79 22.28,42.87 25.59,42.87 26.47,43.76 26.47,59.25 23.93,61.79 U$1.P$2-9
N$29
  Top 0.406: U$3.P$2-10 10.22,84.78 15.81,84.78 17.46,83.13 17.46,81.86 18.73,80.59 18.73,70.43 23.81,65.35 U$1.P$2-10
N$30
  Top 0.406: U$3.P$2-11 6.92,83 9.58,85.67 17.46,85.67 20,83.13 20,81.86 21.27,80.59 21.27,71.44 23.81,68.9 U$1.P$2-11
N$31
  Top 0.406: U$3.P$2-12 3.36,81.6 2.85,81.09 2.85,77.67 7.55,72.97 7.55,54.93 9.2,53.28 25.46,53.28 26.47,54.3 26.47,69.79 U$1.P$2-12
N$32
  Bottom 0.406: U$3.P$1-2 30.03,75.89 28.38,74.24 28.38,35.12 25.59,32.33 15.81,32.33 10.85,37.28 U$1.P$1-2
N$33
  Top 0.406: U$3.P$1-3 27.49,73.73 28.38,72.84 28.38,45.66 25.08,42.36 12.25,42.36 U$1.P$1-3
N$34
  Top 0.406: U$3.P$1-4 24.95,75.38 27.74,72.59 27.74,48.58 24.95,45.79 12.25,45.79 10.85,44.39 U$1.P$1-4
N$35
  Bottom 0.406: U$3.P$1-6 19.87,60.39 10.85,51.38 U$1.P$1-6
N$36
  Bottom 0.406: U$3.P$1-7 17.33,61.41 10.85,54.93 U$1.P$1-7
N$37
  Top 0.406: U$3.P$1-8 14.79,74.11 15.17,73.73 15.17,62.68 10.85,58.36 U$1.P$1-8
N$38
  Top 0.406: U$3.P$1-9 12.25,75.76 14.54,73.47 14.54,65.6 10.85,61.92 U$1.P$1-9
N$39
  Top 0.406: U$3.P$1-10 9.71,77.41 13.9,73.22 13.9,71.06 13.27,70.43 13.27,67.76 10.85,65.35 U$1.P$1-10
N$40
  Top 0.406: U$3.P$1-11 7.17,79.06 13.27,72.97 13.27,71.32 10.85,68.9 U$1.P$1-11
N$41
  Top 0.406: U$3.P$1-12 4.63,78.55 10.73,72.46 U$1.P$1-12
N$42
  Top 0.406: U$3.P$1-5 22.41,77.03 27.11,72.33 27.11,51.38 25.08,49.34 12.25,49.34 10.85,47.95 U$1.P$1-5
N$43
  Bottom 0.406: U$3.P$1-1 32.57,83.25 29.78,86.05 9.96,86.05 7.04,83.13 7.04,81.86 6.03,80.84 6.03,74.36 6.28,74.11 6.28,38.3 U$1.P$1-1
N$450
  Top 1.016: X68.1 23.75,7.23 Q49.1
N$451
  Top 1.016: X68.2 26.29,7 Q49.2
N$452
  Top 1.016: X68.3 28.83,6.77 Q49.3
N$453
  Top 1.016: X69.1 34.16,7.23 Q50.1
N$454
  Top 1.016: X69.2 36.7,7 Q50.2
N$455
  Top 1.016: X69.3 39.24,7.81 38.99,8.07 38.99,7.48 Q50.3
N$456
  Top 1.016: X69.4 41.78,9.59 38.48,12.89 37.01,12.89 Q50.4
N$457
  Top 1.016: X70.1 90.33,82.6 Q51.B
N$458
  Top 1.016: X70.2 87.79,82.09 Q51.E
N$459
  Top 1.016: X70.3 85.25,81.43 86.78,79.91 88.73,79.91 Q51.C
N$500
  Top 1.016: X75.1 1.6,22.63 Q52.1
N$501
  Top 1.016: X75.2 Q52.2
N$502
  Top 1.016: X75.3 6.68,22.63 Q52.3
N$507
  Top 1.016: X77.1 81.93,81.83 Q54.B
N$508
  Top 1.016: X77.2 79.39,81.83 Q54.E
N$509
  Top 1.016: Q54.C 77.95,79.31 77.11,80.15 77.11,84.98 X77.3
N$510
  Top 1.016: X78.1 1.6,7.23 Q55.1
N$511
  Top 1.016: X78.2 4.14,7 Q55.2
N$512
  Top 1.016: X78.3 6.68,6.77 Q55.3
N$513
  Top 1.016: X79.1 12.01,7.23 Q56.1
N$514
  Top 1.016: X79.2 14.55,7 Q56.2
N$515
  Top 1.016: X79.3 17.09,7.81 16.84,8.07 16.84,7.48 Q56.3
N$516
  Top 1.016: X79.4 19.63,9.59 16.33,12.89 14.86,12.89 Q56.4
N$517
  Top 1.016: X80.1 98.73,82.65 Q57.B
N$518
  Top 1.016: X80.2 96.19,82.14 Q57.E
N$519
  Top 1.016: X80.3 93.65,81.49 95.18,79.96 97.13,79.96 Q57.C
N$533
  Top 1.016: 26.03,7.81 26.03,13.66
N$534
  Top 1.016: 4.14,23.41 4.14,28.75
N$535
  Top 1.016: 3.89,7.81 3.89,13.66
N$580
  Top 0.61: R4.2 37.53,45.16 IC1.1
V+  (17 unrouted)
VCC  (via drill 0.6)
  Top 0.61: C4.1 34.72,35 | 34.72,35 IC2.1 | R1.1 35.63,35 | 35.63,35 34.72,35 | 35.63,35 35.63,41.99 R11.2 36.27,41.99 v36.27,43.89 | v36.27,52.15 37.48,52.15 IC1.8
  Bottom 0.61: v36.27,43.89 v36.27,52.15
VDD  (8 unrouted)
VSS  (8 unrouted)

### Text on the board
bPlace: QC
tNames: SO14 | SO14 | Do-214AC | 1206 | 0805 | 0603 | 0402
bNames: SOD123 | TO-252 | SOT89 | SOT23 | SO08